# Altium project blue.PrjPcb
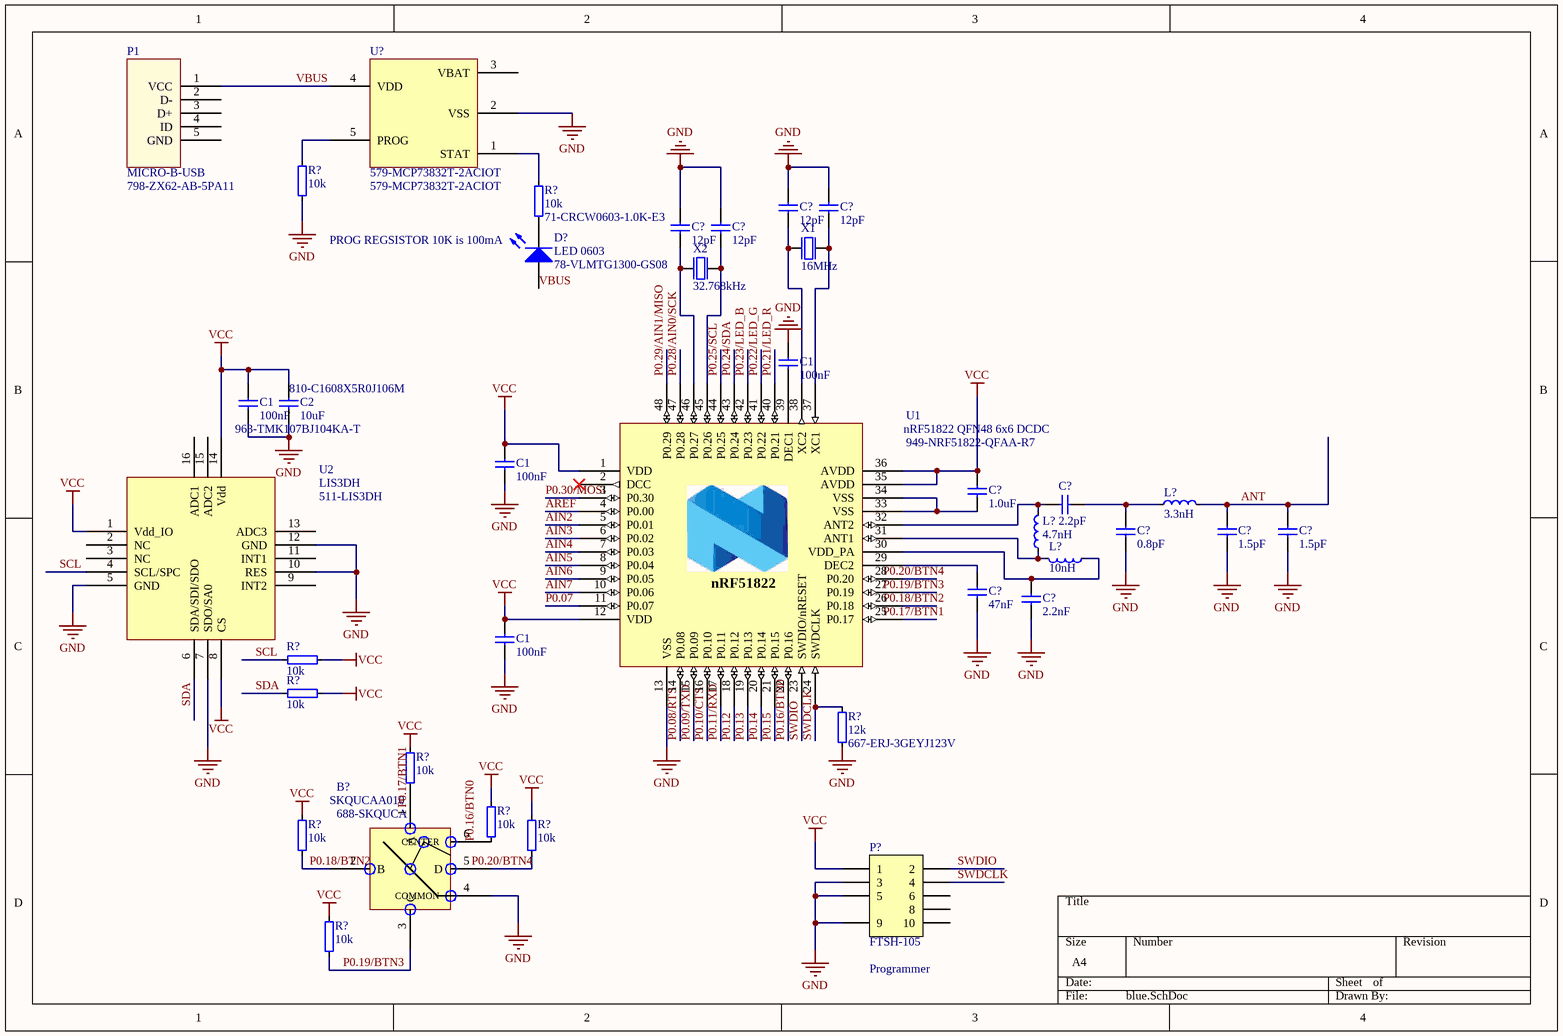
[diagram p0: blue.SchDoc]
1 sheet, 38 parts. Net scope: global (net labels, ports and power ports of the same name join across sheets).
Board file: blue.PcbDoc

## Sheet blue.SchDoc
size A4

### Parts
(Parts that share a designator on the sheet are numbered #1, #2 ... from top to bottom, then left to right.)
B?  SKQUCAA010  Supplier Part Number 1: 688-SKQUCA  [SKQU_SnapIn]
C1#1  100nF  [CAPC1608X06L]
C1#2  100nF  Supplier Part Number 1: 963-TMK107BJ104KA-T  [CAPC1608X06L]
C1#3  100nF  [CAPC1608X06L]
C1#4  100nF  [CAPC1608X06L]
C2  10uF  Supplier Part Number 1: 810-C1608X5R0J106M  [CAPC1608X06L]
C?#1  12pF  [CAPC1608X06L]
C?#2  12pF  [CAPC1608X06L]
C?#3  12pF  [CAPC1608X06L]
C?#4  12pF  [CAPC1608X06L]
C?#5  2.2pF  [CAPC1005X04L]
C?#6  1.0uF  [CAPC1608X06L]
C?#7  0.8pF  [CAPC1005X04L]
C?#8  1.5pF  [CAPC1005X04L]
C?#9  1.5pF  [CAPC1005X04L]
C?#10  47nF  [CAPC1005X04L]
C?#11  2.2nF  [CAPC1005X04L]
D?  LED 0603  Supplier Part Number 1: 78-VLMTG1300-GS08  [LED1608x06M]
L?#1  3.3nH  [INDC1005X04L]
L?#2  4.7nH  [INDC1005X04L]
L?#3  10nH  [INDC1005X04L]
P1  MICRO-B-USB  Supplier Part Number 1: 798-ZX62-AB-5PA11  [MICRO-B-USB (Hirose)]
P?  FTSH-105  [HDR_2x5-SMD-1.27mm-SWD]
R?#1  10k  [INDC1608X06L]
R?#2  10k  Supplier Part Number 1: 71-CRCW0603-1.0K-E3  [INDC1608X06L]
R?#3  10k  [INDC1608X06L]
R?#4  10k  [INDC1608X06L]
R?#5  12k  Supplier Part Number 1: 667-ERJ-3GEYJ123V  [INDC1608X06L]
R?#6  10k  [INDC1608X06L]
R?#7  10k  [INDC1608X06L]
R?#8  10k  [INDC1608X06L]
R?#9  10k  [INDC1608X06L]
R?#10  10k  [INDC1608X06L]
U1  nRF51822 QFN48 6x6 DCDC  Supplier Part Number 1: 949-NRF51822-QFAA-R7  [QFN40P600X600X90-48N]
U2  LIS3DH  Supplier Part Number 1: 511-LIS3DH  [LGA16-3X3X1_M]
U?  579-MCP73832T-2ACIOT  [SOT-23]
X1  16MHz  [BT-XTAL_2520]
X2  32.768kHz  [FC-135]

### Nets
GND: B?.4(COMMON) C1#1.1 C1#2.1 C1#3.2 C1#4.1 C2.1 C?#1.2 C?#2.2 C?#3.2 C?#4.2 C?#7.1 C?#8.1 C?#9.1 C?#10.2 C?#11.1 P?.3 P?.5 P?.9 R?#1.1 R?#5.1 U1.13(VSS) U1.49 U2.5(GND) U2.7(SDO/SA0) U2.10(RES) U2.12(GND) U?.2(VSS) X1.2(GND) X1.4(GND)
VCC: C1#2.2 C1#3.1 C1#4.2 C2.2 C?#6.2 P?.1 R?#3.2 R?#4.2 R?#6.2 R?#7.2 R?#8.2 R?#9.2 R?#10.2 U1.1(VDD) U1.12(VDD) U1.35(AVDD) U1.36(AVDD) U2.1(Vdd_IO) U2.8(CS) U2.14(Vdd)
AIN2: U1.5(P0.01)
AIN3: U1.6(P0.02)
AIN4: U1.7(P0.03)
AIN5: U1.8(P0.04)
AIN6: U1.9(P0.05)
AIN7: U1.10(P0.06)
ANT: C?#8.2 C?#9.2 L?#1.2
AREF: U1.4(P0.00)
P0.07: U1.11(P0.07)
P0.08/RTS: U1.14(P0.08)
P0.09/TXD: U1.15(P0.09)
P0.10/CTS: U1.16(P0.10)
P0.11/RXD: U1.17(P0.11)
P0.12: U1.18(P0.12)
P0.13: U1.19(P0.13)
P0.14: U1.20(P0.14)
P0.15: U1.21(P0.15)
P0.16/BTN0: U1.22(P0.16)
P0.18/BTN2: B?.2(B) R?#8.1
P0.19/BTN3: B?.3(C) R?#10.1
P0.21/LED_R: U1.40(P0.21)
P0.22/LED_G: U1.41(P0.22)
P0.23/LED_B: U1.42(P0.23)
P0.24/SDA: U1.43(P0.24)
P0.25/SCL: U1.44(P0.25)
P0.28/AIN0/SCK: U1.47(P0.28)
P0.29/AIN1/MISO: U1.48(P0.29)
P0.30/MOSI: U1.3(P0.30)
SCL: R?#3.1 U2.4(SCL/SPC)
SDA: R?#4.1 U2.6(SDA/SDI/SDO)
SWDCLK: P?.4 R?#5.2 U1.24(SWDCLK)
SWDIO: P?.2 U1.23(SWDIO/nRESET)
VBUS: D?.A P1.1(VCC) U?.4(VDD)
NetB?_1: B?.1(A) R?#6.1
NetB?_5: B?.5(D) R?#9.1
NetB?_6: B?.6(CENTER) R?#7.1
NetC1#1_2: C1#1.2 U1.39(DEC1)
NetC?#1_1: C?#1.1 U1.38(XC2) X1.1(inp)
NetC?#2_1: C?#2.1 U1.37(XC1) X1.3(out)
NetC?#3_1: C?#3.1 U1.46(P0.27) X2.1(inp)
NetC?#4_1: C?#4.1 U1.45(P0.26) X2.2(out)
NetC?#5_1: C?#5.1 L?#2.2 U1.32(ANT2)
NetC?#5_2: C?#5.2 C?#7.2 L?#1.1
NetC?#6_1: C?#6.1 U1.33(VSS) U1.34(VSS)
NetC?#10_1: C?#10.1 U1.29(DEC2)
NetC?#11_2: C?#11.2 L?#3.1 U1.30(VDD_PA)
NetD?_K: D?.K R?#2.1
NetL?#2_1: L?#2.1 L?#3.2 U1.31(ANT1)
NetR?#1_2: R?#1.2 U?.5(PROG)
NetR?#2_2: R?#2.2 U?.1(STAT)

Not connected (* = marked no-connect by the designer): P1 2(D-) 3(D+) 4(ID) 5(GND); P? 6 8 10; U1 2(DCC)* 25(P0.17) 26(P0.18) 27(P0.19) 28(P0.20); U2 2(NC) 3(NC) 9(INT2) 11(INT1) 13(ADC3) 15(ADC2) 16(ADC1); U? 3(VBAT)

### Notes on the sheet
- PROG REGSISTOR 10K is 100mA
- (near P?) Programmer
- Labels drawn without touching a wire or pin: P0.16/BTN0, P0.17/BTN1, P0.18/BTN2, P0.19/BTN3, P0.20/BTN4
- (in symbol nRF51822_QFN48_DCDC) nRF51822

### Library data of the parts
B? = SKQUCAA010: 4-direction switch  10mm 160gf snap-in; Supplier 1: Mouser
C1#1-C1#4 = CAP_0603_100nF: Capacitor, X5R, ?0%; Part Number: C0603-1?; Note: 10V; Artikkelnr Noca: 20039205; Supplier 1: Mouser; Manufacturer: *; Manufacturer Part Number: *; Datasheet: *; Footprint: 0603; LatestRevisionDate: 2009-11-23; Pin Count: 2; Publisher: Nordic Semiconductor; Published: 2009-05-08; Value: 100nF; Supplier: *; Supplier part number: *; 2nd source Supplier: *; 2nd source part number: *
  C1#1 C1#3 C1#4: Supplier Part Number 1: 963-TMK107BJ104KA-T
C2 = CAP_0603_10uF: Capacitor, X5R, ?0%; Part Number: C0603-1?; Note: 10V; Artikkelnr Noca: 20039205; Manufacturer: *; Manufacturer Part Number: *; Datasheet: *; Footprint: 0603; LatestRevisionDate: 2009-11-23; Pin Count: 2; Publisher: Nordic Semiconductor; Published: 2009-05-08; Value: 10uF; Supplier: *; Supplier part number: *; 2nd source Supplier: *; 2nd source part number: *; Supplier 1: Mouser
C?#1-C?#4 = CAP_0603_12pF: Capacitor, X5R, ?0%; Part Number: C0603-1?; Note: 10V; Artikkelnr Noca: 20039205; Manufacturer: *; Manufacturer Part Number: *; Datasheet: *; Footprint: 0603; LatestRevisionDate: 2009-11-23; Pin Count: 2; Publisher: Nordic Semiconductor; Published: 2009-05-08; Value: 12pF; Supplier: *; Supplier part number: *; 2nd source Supplier: *; 2nd source part number: *; Supplier 1: Mouser; Supplier Part Number 1: 581-0603YA120JAT2A
C?#5 = CAP_0402_2.2pF: Capacitor, NP0, ?%; Part Number: C0402-12p; Note: 50V; Artikkelnr Noca: 20029159; Manufacturer: *; Manufacturer Part Number: *; Datasheet: *; Footprint: 0402; LatestRevisionDate: 2011-05-11; Pin Count: 2; Publisher: Nordic Semiconductor; Published: 2009-05-08; Value: 2.2pF; Supplier: *; Supplier part number: *; 2nd source Supplier: *; 2nd source part number: *
C?#6 = CAP_0603_1uF: Capacitor, X5R, ?0%; Part Number: C0603-1?; Note: 10V; Artikkelnr Noca: 20039205; Manufacturer: *; Manufacturer Part Number: *; Datasheet: *; Footprint: 0603; LatestRevisionDate: 2009-11-23; Pin Count: 2; Publisher: Nordic Semiconductor; Published: 2009-05-08; Value: 1.0uF; Supplier: *; Supplier part number: *; 2nd source Supplier: *; 2nd source part number: *; Supplier 1: Mouser; Supplier Part Number 1: 81-GCM188R71C105K64D
C?#7 = CAP_0402_0.8pF: Capacitor, NP0, ?%; Part Number: C0402-12p; Note: 50V; Artikkelnr Noca: 20029159; Manufacturer: *; Manufacturer Part Number: *; Datasheet: *; Footprint: 0402; LatestRevisionDate: 2011-05-11; Pin Count: 2; Publisher: Nordic Semiconductor; Published: 2009-05-08; Value: 0.8pF; Supplier: *; Supplier part number: *; 2nd source Supplier: *; 2nd source part number: *
C?#8 C?#9 = CAP_0402_1.5pF: Capacitor, NP0, ?%; Part Number: C0402-12p; Note: 50V; Artikkelnr Noca: 20029159; Manufacturer: *; Manufacturer Part Number: *; Datasheet: *; Footprint: 0402; LatestRevisionDate: 2011-05-11; Pin Count: 2; Publisher: Nordic Semiconductor; Published: 2009-05-08; Value: 1.5pF; Supplier: *; Supplier part number: *; 2nd source Supplier: *; 2nd source part number: *
C?#10 = CAP_0402_47nF: Capacitor, NP0, ?%; Part Number: C0402-12p; Note: 50V; Artikkelnr Noca: 20029159; Manufacturer: *; Manufacturer Part Number: *; Datasheet: *; Footprint: 0402; LatestRevisionDate: 2011-05-11; Pin Count: 2; Publisher: Nordic Semiconductor; Published: 2009-05-08; Value: 47nF; Supplier: *; Supplier part number: *; 2nd source Supplier: *; 2nd source part number: *
C?#11 = CAP_0402_2.2nF: Capacitor, NP0, ?%; Part Number: C0402-12p; Note: 50V; Artikkelnr Noca: 20029159; Manufacturer: *; Manufacturer Part Number: *; Datasheet: *; Footprint: 0402; LatestRevisionDate: 2011-05-11; Pin Count: 2; Publisher: Nordic Semiconductor; Published: 2009-05-08; Value: 2.2nF; Supplier: *; Supplier part number: *; 2nd source Supplier: *; 2nd source part number: *
D? = LED_0603: Typical RED, GREEN, YELLOW, AMBER GaAs LED; Published: 8-Jun-2000; LatestRevisionDate: 17-Jul-2002; LatestRevisionNote: Re-released for DXP Platform.; PackageVersion: Feb-2002; PackageReference: 3.2X1.6X1.1; Publisher: Altium Limited; PackageDescription: SM LED; 2 Flat Leads; Supplier 1: Mouser
L?#1 = IND_0402_3.3nH: High frequency chip inductor ?0%; Part Number: L0402-15n; Manufacturer: Taiyo Yuden; Manufacturer Part Number: HK100515NJ-T; 2nd source part number: 658-1328; Artikkelnr Noca: 33029323; Footprint: 0402; LatestRevisionDate: 2011-12-06; Pin Count: 2; Publisher: Nordic Semiconductor; Published: 2010-07-12; Value: 3.3nH; Note: *; Supplier: Digi-Key; Datasheet: http://www.yuden.co.jp/productdata/catalog/en/mlci04_e.pdf; Supplier part number: 587-1521-1-ND; 2nd source Supplier: Farnell
L?#2 = IND_0402_4.7nH: High frequency chip inductor ?0%; Part Number: L0402-15n; Manufacturer: Taiyo Yuden; Manufacturer Part Number: HK100515NJ-T; 2nd source part number: 658-1328; Artikkelnr Noca: 33029323; Footprint: 0402; LatestRevisionDate: 2011-12-06; Pin Count: 2; Publisher: Nordic Semiconductor; Published: 2010-07-12; Value: 4.7nH; Note: *; Supplier: Digi-Key; Datasheet: http://www.yuden.co.jp/productdata/catalog/en/mlci04_e.pdf; Supplier part number: 587-1521-1-ND; 2nd source Supplier: Farnell
L?#3 = IND_0402_10nH: High frequency chip inductor ?0%; Part Number: L0402-15n; Manufacturer: Taiyo Yuden; Manufacturer Part Number: HK100515NJ-T; 2nd source part number: 658-1328; Artikkelnr Noca: 33029323; Footprint: 0402; LatestRevisionDate: 2011-12-06; Pin Count: 2; Publisher: Nordic Semiconductor; Published: 2010-07-12; Value: 10nH; Note: *; Supplier: Digi-Key; Datasheet: http://www.yuden.co.jp/productdata/catalog/en/mlci04_e.pdf; Supplier part number: 587-1521-1-ND; 2nd source Supplier: Farnell
P? = CONN-2x5-SWD: SAMTEC - FTSH-105-01-L-DV - HEADER, 1.27MM, SMD, 10WAY; Part Number: Samtec Micro Header 10 - SWD; Artikkelnr Noca: 55019196; Manufacturer: Samtec; Manufacturer Part Number: FTSH-105-01-L-DV; Datasheet: http://www.farnell.com/datasheets/81359.pdf; LatestRevisionDate: 2010-11-25; Publisher: Nordic Semiconductor; Published: 2010-11-25; Value: FTSH-105; Note: HEADER, 1.27MM, SMD, 10WAY; Supplier: Farnell; Supplier part number: 166-7759; 2nd source Supplier: *; 2nd source part number: *
R?#1 R?#3 R?#4 R?#6-R?#10 = RES_0603_10k: Resistor, ?%, 0.063W; Part Number: R0402-10k; Note: Chip Res 1%; Artikkelnr Noca: 27049097; Manufacturer: *; Manufacturer Part Number: *; Datasheet: *; Footprint: 0603; LatestRevisionDate: 2009-11-23; Pin Count: 2; Publisher: Nordic Semiconductor; Published: 2009-05-08; Value: 10k; Supplier: *; Supplier part number: *; 2nd source Supplier: *; 2nd source part number: *; Supplier 1: Mouser; Supplier Part Number 1: 667-ERJ-3EKF1002V
R?#2 = RES_0603_1k: Resistor, ?%, 0.063W; Part Number: R0402-10k; Note: Chip Res 1%; Artikkelnr Noca: 27049097; Manufacturer: *; Manufacturer Part Number: *; Datasheet: *; Footprint: 0603; LatestRevisionDate: 2009-11-23; Pin Count: 2; Publisher: Nordic Semiconductor; Published: 2009-05-08; Value: 10k; Supplier: *; Supplier part number: *; 2nd source Supplier: *; 2nd source part number: *; Supplier 1: Mouser
R?#5 = RES_0603_12k: Resistor, ?%, 0.063W; Part Number: R0402-10k; Note: Chip Res 1%; Artikkelnr Noca: 27049097; Manufacturer: *; Manufacturer Part Number: *; Datasheet: *; Footprint: 0603; LatestRevisionDate: 2009-11-23; Pin Count: 2; Publisher: Nordic Semiconductor; Published: 2009-05-08; Value: 12k; Supplier: *; Supplier part number: *; 2nd source Supplier: *; 2nd source part number: *; Supplier 1: Mouser
U1 = nRF51822_QFN48_DCDC: nRF51822 - Multi-protocol Bluetooth Low Energy and 2.4GHz proprietary system-on-chip; Part Number: nRF51822-Q48-6x6_DCDC; Manufacturer: Nordic Semiconductor; Manufacturer Part Number: nRF51822-QFAA; Note: nRF51822 - QFN48 6x6 0.4mm pitch; Artikkelnr Noca: 15079200; Datasheet: *; Footprint: QFN-48; LatestRevisionDate: 2012-07-10; Pin Count: 48; Publisher: Nordic Semiconductor; Published: 2012-07-08; Value: nRF51822 QFN48 6x6 DCDC; Supplier: Nordic Semiconductor; Supplier part number: *; 2nd source Supplier: *; 2nd source part number: *; Supplier 1: Mouser
U? = MCP73832: Supplier 1: Mouser; Supplier Part Number 1: 579-MCP73832T-2ACIOT
X1 = XTAL_TSX-2520: XTAL SMD 2520, 16MHz, 8pF, ?5ppm; Part Number: NX2520SA-16MHZ-STD-CSW-5; Manufacturer: NDK; Note: XTAL SMD 16.000MHz; Artikkelnr Noca: 22019192; Manufacturer Part Number: NX2520SA-16MHZ-STD-CSW-5; Datasheet: http://www.ndk.com/images/products/catalog/c_NX2520SA-STD-CSW-5_e.pdf; LatestRevisionDate: 2012-06-15; Pin Count: 4; Publisher: Nordic Semiconductor; Published: 2012-06-15; Value: 16MHz; Supplier: Digi-Key; Supplier part number: 644-1169-1-ND; 2nd source Supplier: *; 2nd source part number: *; Supplier 1: Digi-Key; Supplier Part Number 1: 644-1169-1-ND
X2 = XTAL_HC49: EPSON TOYOCOM - FC-135 32.768KHZ ?0PPM,9.0PF - CRYSTAL, SM, WATCH; Part Number: XTAL_FC-135 32.768k; 2nd source part number: 127-8037; Note: XTAL SMD 32.768kHz, 3215; Artikkelnr Noca: 22019091; Manufacturer: Epson Toyocom; Manufacturer Part Number: FC-135 32.768KHZ ?0PPM,9.0PF; Datasheet: http://www.farnell.com/datasheets/57480.pdf; LatestRevisionDate: 2010-10-18; Pin Count: 2; Publisher: Nordic Semiconductor; Published: 2010-10-18; Value: 32.768kHz; Supplier: Digi-Key; Supplier part number: FC-135 32.7680KA-AC-ND; 2nd source Supplier: Farnell; Supplier 1: Mouser; Supplier Part Number 1: 732-FC-13532.768KAAC
P1 = MICRO-B-USB: Supplier 1: Mouser
U2 = LIS3DH: Supplier 1: Mouser